# Altium schematic sheet brake_driver.SchDoc
size Letter
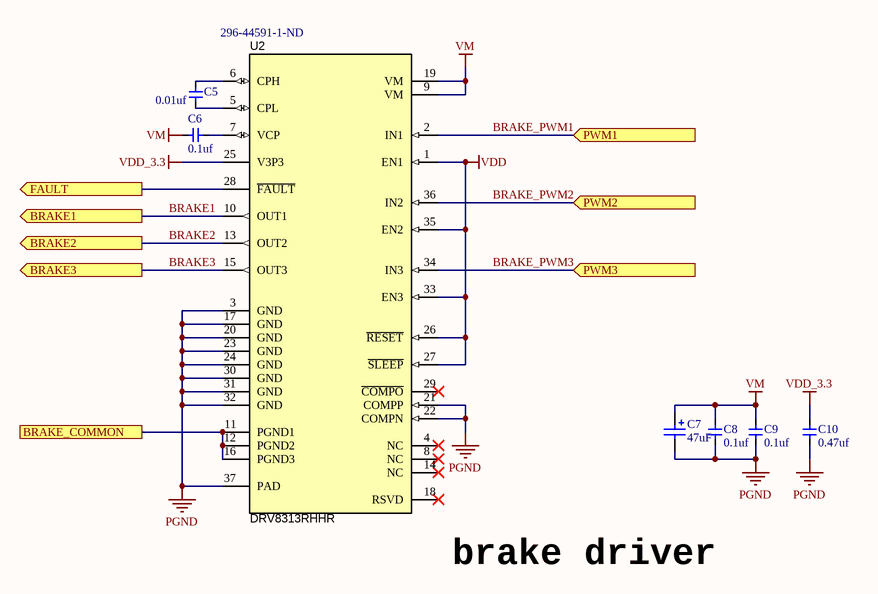
[diagram p0: brake_driver.SchDoc]

## Parts
C5  value 0.01uf  [CAP_0402]  (hidden comment: Cap_0402)
C6  value 0.1uf  [CAP_0402]  (hidden comment: Cap_0402)
C7  value 47uF  [WCAP-PSLC_10x12.4]  (hidden comment: PSEF124470M063DVCTFB000)
C8  value 0.1uf  [CAP_0402]  (hidden comment: Cap_0402)
C9  value 0.1uf  [CAP_0402]  (hidden comment: Cap_0402)
C10  value 0.47uf  [CAP_0402]  (hidden comment: Cap_0402)
U2  DRV8313RHHR  Supplier Part Number 1: 296-44591-1-ND  [RHH0036C]

## Ports
BRAKE1 (out), BRAKE2 (out), BRAKE3 (out), BRAKE_COMMON, FAULT (out), PWM1 (in), PWM2 (in), PWM3 (in)

## Nets
PGND: C7.2(N) C8.2 C9.2 C10.2 U2.3(GND) U2.17(GND) U2.20(GND) U2.21(COMPP) U2.22(COMPN) U2.23(GND) U2.24(GND) U2.30(GND) U2.31(GND) U2.32(GND) U2.37(PAD)
VDD: U2.1(EN1) U2.26(~{RESET}) U2.27(~{SLEEP}) U2.33(EN3) U2.35(EN2)
VDD_3.3: C10.1 U2.25(V3P3)
VM: C6.1 C7.1(P) C8.1 C9.1 U2.9(VM) U2.19(VM)
BRAKE1: U2.10(OUT1) ; port BRAKE1
BRAKE2: U2.13(OUT2) ; port BRAKE2
BRAKE3: U2.15(OUT3) ; port BRAKE3
BRAKE_COMMON: U2.11(PGND1) U2.12(PGND2) U2.16(PGND3) ; port BRAKE_COMMON
BRAKE_PWM1: U2.2(IN1) ; port PWM1
BRAKE_PWM2: U2.36(IN2) ; port PWM2
BRAKE_PWM3: U2.34(IN3) ; port PWM3
FAULT: U2.28(~{FAULT}) ; port FAULT
NetC5_1: C5.1 U2.5(CPL)
NetC5_2: C5.2 U2.6(CPH)
NetC6_2: C6.2 U2.7(VCP)

Not connected (* = marked no-connect by the designer): U2 4(NC)* 8(NC)* 14(NC)* 18(RSVD)* 29(~{COMPO})*

## Notes on the sheet
- (near U2) brake driver

## Library data of the parts
C5 C6 C8-C10 = Cap_0402: Capacitor
C7 = 875075761005: WCAP-PSLC Aluminum Polymer Capacitors, size Ф10x12.4mm, 63V DC, 47uF; Rated Voltage: 50V DC; ComponentLink1Description: Manufacturer; ComponentLink1URL: http://www.we-online.de; ComponentLink2Description: Datasheet; ComponentLink2URL: http://katalog.we-online.de/pbs/datasheet/875075761005.pdf; Part Number: 875075761005; Published Date: June 2017; Publisher: Wurth Elektronik; Size: Ф10x12.4mm; Life Cycle: 2000h; Operating Temperature: -55 °C up to +105 °C
U2 = DRV8313RHHR: 2.5-A Triple 1/2-H Bridge Driver, RHH0036C; Manufacturer: Texas Instruments; SymbolCreator: Altium; SizeArea_mm2: 36; SizeAreaWB_mm2: 64; SizeX_mm: 6; SizeZ_mm: 1; CompType: IC; U/M: EA; Output Current: 1.75A; Min Supply Voltage: 8V; Max Supply Voltage: 60V; SymbolVersion: 2015-08-10; PartNumber: DRV8313RHHR; Alternate PartNumber: DRV8313RHH; PackageReference: RHH0036C; PackageDescription: VQFN-36; MountType: SMT; SizeY_mm: 6; ComponentLink1Description: Datasheet Link; ComponentLink1URL: http://www.ti.com/lit/ds/symlink/drv8813.pdf; RoHS: Y; Publisher: Texas Instruments; LatestRevisionDate: 2016-08-25; Alternate Manufacturer: Texas Instruments; Supplier 1: Digi-Key; Manufacturer Part Number: DRV8313RHHR; Stock 1: 3408; Pricing 1: 1=3.65, 10=3.28, 100=2.6874, 500=2.28772, 1000=1.9294 (USD); Case/Package: VQFN; Number of Pins: 36; Min Operating Temperature: -40°C; Max Operating Temperature: 125°C; Number of Outputs: 1; Packaging: Cut Tape; REACH SVHC: No SVHC; Lead Free: Lead Free; ComponentLink2URL: http://www.ti.com/lit/ds/symlink/drv8313.pdf; ComponentLink2Description: http://www.ti.com/lit/ds/symlink/drv8313.pdf; ComponentLink3URL: http://www.ti.com/lit/gpn/drv8313; ComponentLink3Description: http://www.ti.com/lit/gpn/drv8313; ComponentLink4URL: http://www.farnell.com/datasheets/2075778.pdf; ComponentLink4Description: http://www.farnell.com/datasheets/2075778.pdf